# EAGLE schematic mrShark 09 (EAGLE 6.3)

## Sheet 1 of 4
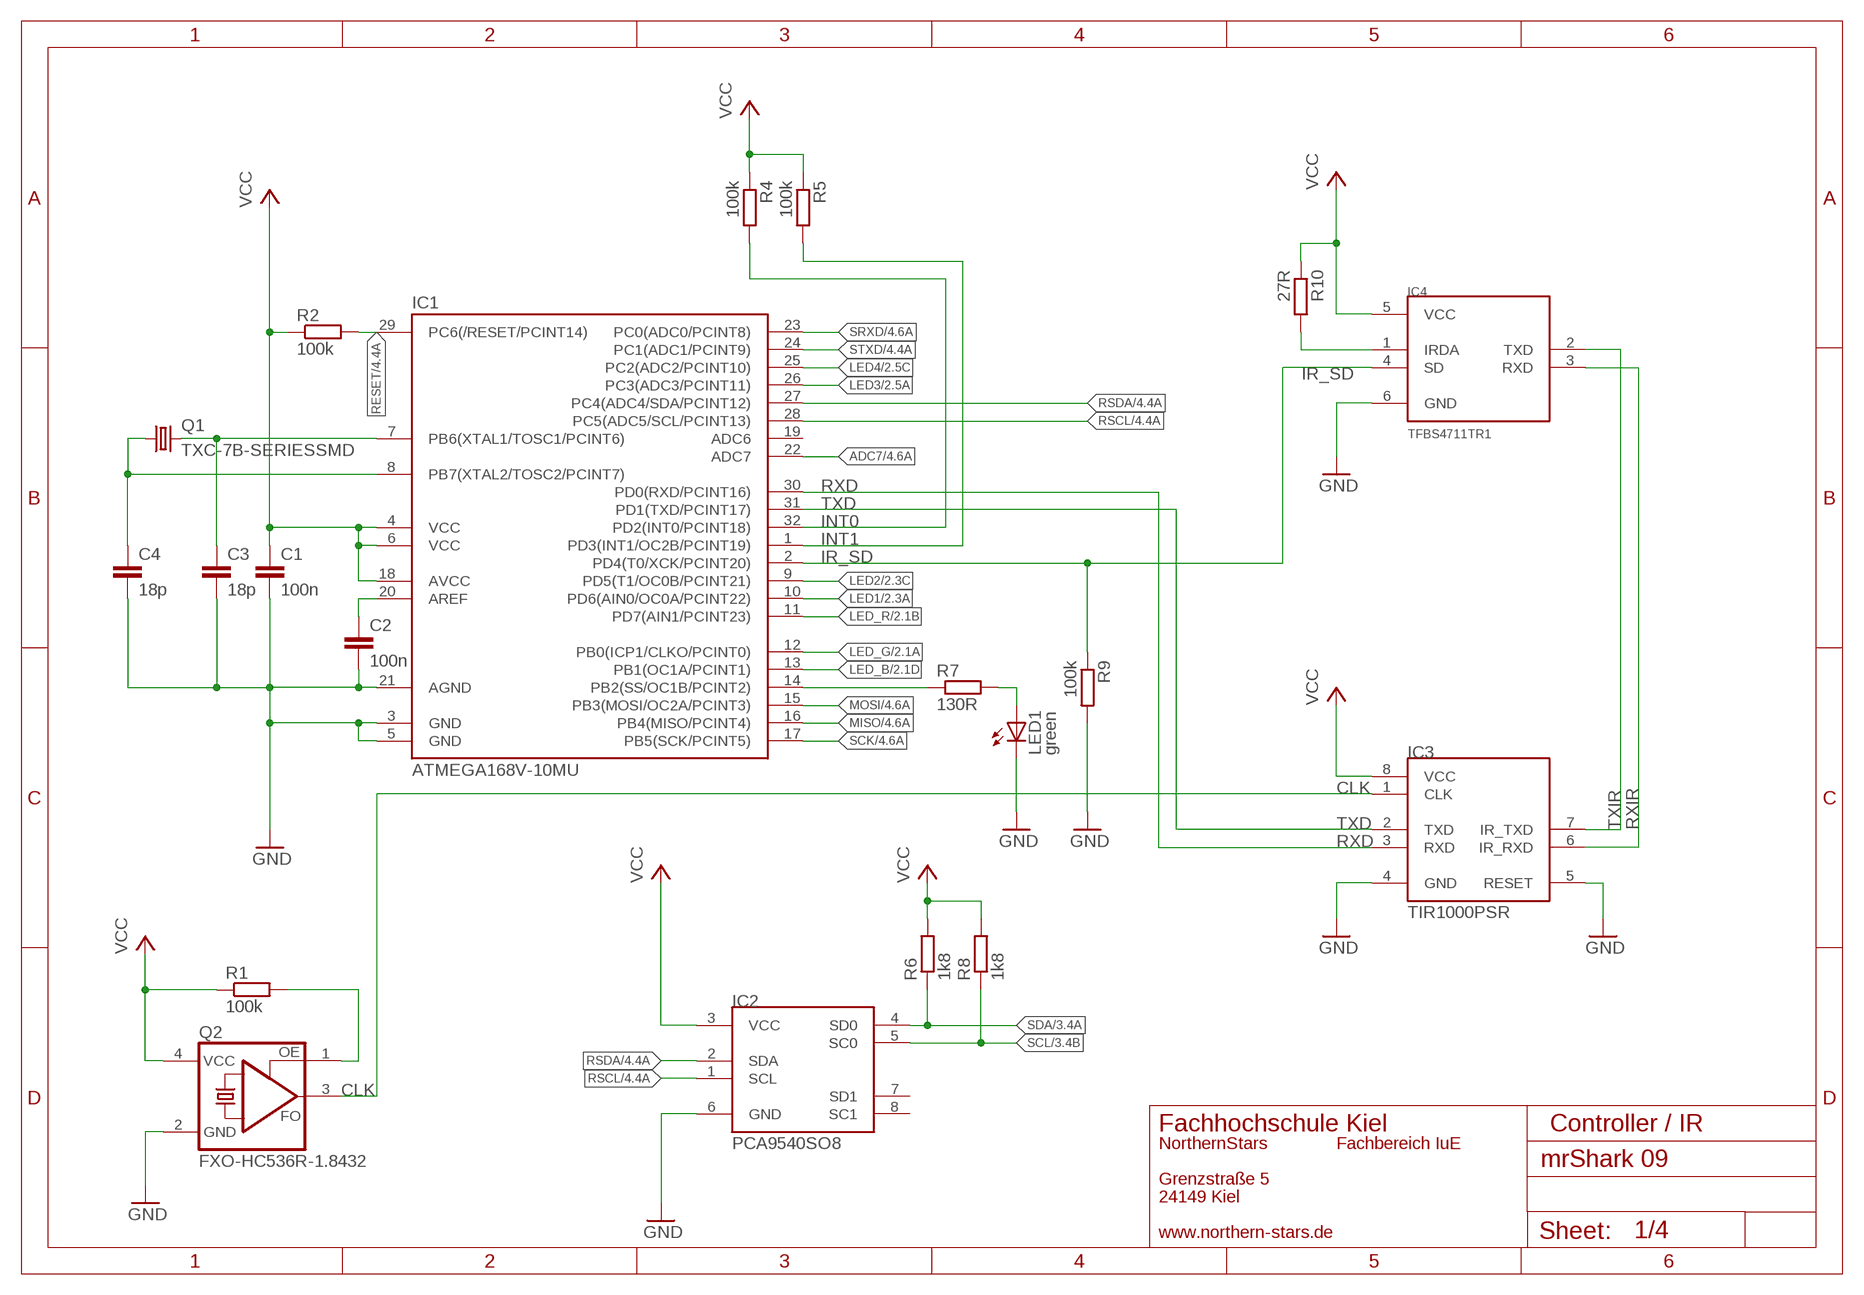
[diagram p0: schematic, sheet 1]

### Parts
C1  100n  C-EUC1206  [C1206]
C2  100n  C-EUC1206  [C1206]
C3  18p  C-EUC0805  [C0805]
C4  18p  C-EUC0805  [C0805]
IC1  ATMEGA168V-10MU  ATMEGA48/88/168-AU  [TQFP32-08]
IC2  PCA9540SO8  [SO8]
IC3  TIR1000PSR  [SO-08]
IC4  TFBS4711TR1  [TFBS4711]
LED1  green  LEDCHIPLED_0603  [CHIPLED_0603]
Q1  TXC-7B-SERIESSMD  [TXC_7B_SERIES]
Q2  FXO-HC536R-1.8432  HC536R  [HC536]
R1  100k  R-EU_R1206  [R1206]
R2  100k  R-EU_R1206  [R1206]
R4  100k  R-EU_R1206  [R1206]
R5  100k  R-EU_R1206  [R1206]
R6  1k8  R-EU_R1206  [R1206]
R7  130R  R-EU_R1206  [R1206]
R8  1k8  R-EU_R1206  [R1206]
R9  100k  R-EU_R1206  [R1206]
R10  27R  R-EU_R1206  [R1206]

### Nets
ADC7: IC1.22(ADC7) ; also sheet 4
CLK: IC3.1(CLK) Q2.3(FO)
GND: C1.2 C2.2 C3.2 C4.2 IC1.3(GND) IC1.5(GND) IC1.21(AGND) IC2.6(GND) IC3.4(GND) IC3.5(RESET) IC4.6(GND) LED1.C Q2.2(GND) R9.2 ; also sheet 2,3,4
INT0: IC1.32(PD2(INT0/PCINT18)) R4.2 ; also sheet 4
INT1: IC1.1(PD3(INT1/OC2B/PCINT19)) R5.2 ; also sheet 4
IR_SD: IC1.2(PD4(T0/XCK/PCINT20)) IC4.4(SD) R9.1
IRDA: IC4.1(IRDA) R10.2
LED1: IC1.10(PD6(AIN0/OC0A/PCINT22)) ; also sheet 2
LED2: IC1.9(PD5(T1/OC0B/PCINT21)) ; also sheet 2
LED3: IC1.26(PC3(ADC3/PCINT11)) ; also sheet 2
LED4: IC1.25(PC2(ADC2/PCINT10)) ; also sheet 2
LED_B: IC1.13(PB1(OC1A/PCINT1)) ; also sheet 2
LED_G: IC1.12(PB0(ICP1/CLKO/PCINT0)) ; also sheet 2
LED_R: IC1.11(PD7(AIN1/PCINT23)) ; also sheet 2
MISO: IC1.16(PB4(MISO/PCINT4)) ; also sheet 4
MOSI: IC1.15(PB3(MOSI/OC2A/PCINT3)) ; also sheet 4
N$3: IC1.14(PB2(SS/OC1B/PCINT2)) R7.1
N$4: Q2.1(OE) R1.2
N$8: LED1.A R7.2
N$13: C3.1 IC1.7(PB6(XTAL1/TOSC1/PCINT6)) Q1.3
N$14: C4.1 IC1.8(PB7(XTAL2/TOSC2/PCINT7)) Q1.1
N$26: C2.1 IC1.20(AREF)
RESET: IC1.29(PC6(/RESET/PCINT14)) R2.2 ; also sheet 4
RSCL: IC1.28(PC5(ADC5/SCL/PCINT13)) IC2.1(SCL) ; also sheet 4
RSDA: IC1.27(PC4(ADC4/SDA/PCINT12)) IC2.2(SDA) ; also sheet 4
RXD: IC1.30(PD0(RXD/PCINT16)) IC3.3(RXD)
RXIR: IC3.6(IR_RXD) IC4.3(RXD)
SCK: IC1.17(PB5(SCK/PCINT5)) ; also sheet 4
SCL: IC2.5(SC0) R8.1 ; also sheet 3,4
SDA: IC2.4(SD0) R6.1 ; also sheet 3,4
SRXD: IC1.23(PC0(ADC0/PCINT8)) ; also sheet 4
STXD: IC1.24(PC1(ADC1/PCINT9)) ; also sheet 4
TXD: IC1.31(PD1(TXD/PCINT17)) IC3.2(TXD)
TXIR: IC3.7(IR_TXD) IC4.2(TXD)
VCC: C1.1 IC1.4(VCC) IC1.6(VCC) IC1.18(AVCC) IC2.3(VCC) IC3.8(VCC) IC4.5(VCC) Q2.4(VCC) R1.1 R2.1 R4.1 R5.1 R6.2 R8.2 R10.1 ; also sheet 2,3,4
Unconnected: IC1.19(ADC6) IC2.7(SD1) IC2.8(SC1)

### Notes on the sheet
- Fachhochschule Kiel | Controller / IR
- NorthernStars | Fachbereich IuE
- Grenzstraße 5
- 24149 Kiel
- www.northern-stars.de

## Sheet 2 of 4
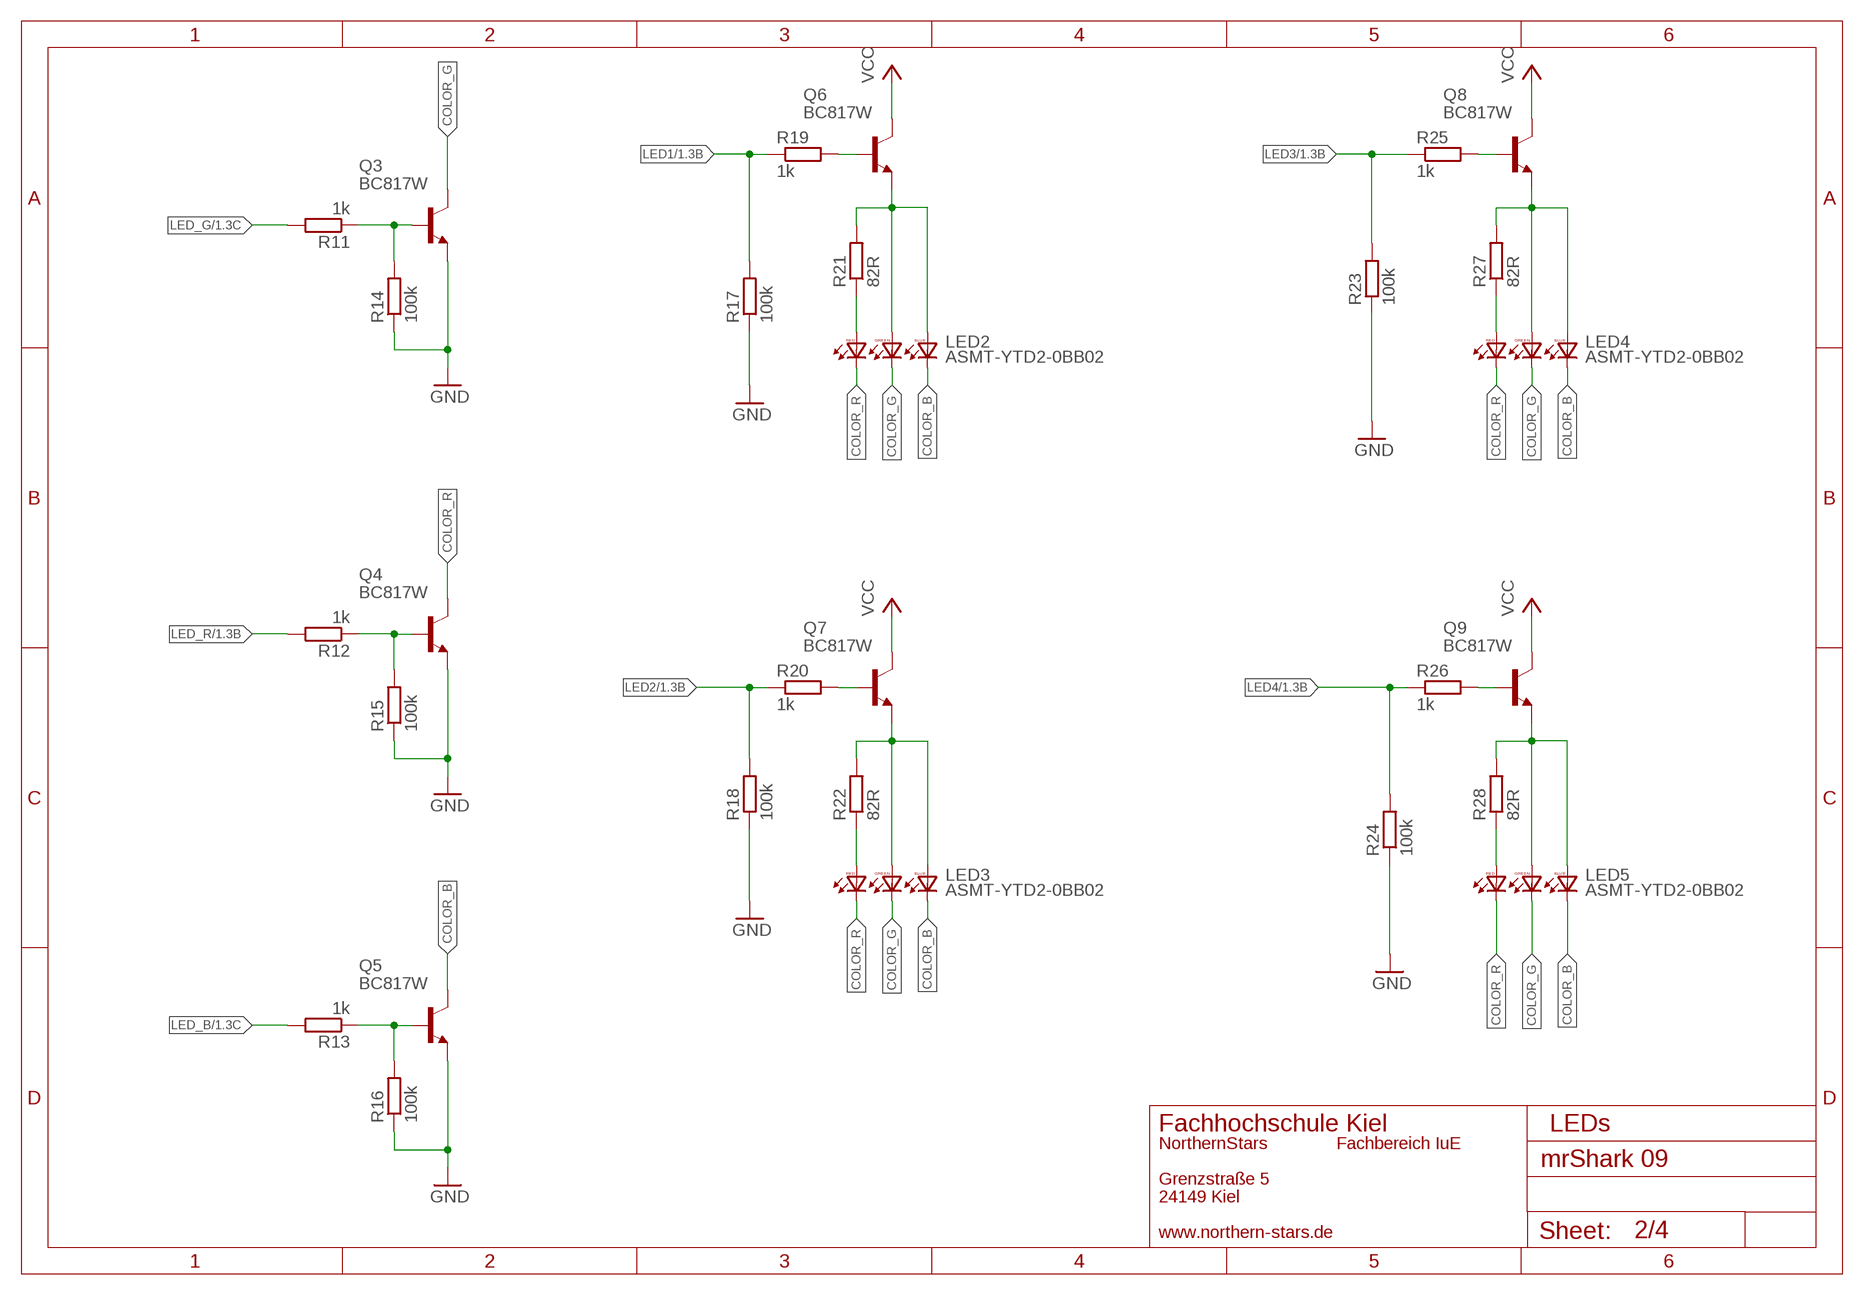
[diagram p1: schematic, sheet 2]

### Parts
LED2  ASMT-YTD2-0BB02  PLCC6K  [PLCC6K]
LED3  ASMT-YTD2-0BB02  PLCC6K  [PLCC6K]
LED4  ASMT-YTD2-0BB02  PLCC6K  [PLCC6K]
LED5  ASMT-YTD2-0BB02  PLCC6K  [PLCC6K]
Q3  BC817W  [SOT323-BEC]
Q4  BC817W  [SOT323-BEC]
Q5  BC817W  [SOT323-BEC]
Q6  BC817W  [SOT323-BEC]
Q7  BC817W  [SOT323-BEC]
Q8  BC817W  [SOT323-BEC]
Q9  BC817W  [SOT323-BEC]
R11  1k  R-EU_R1206  [R1206]
R12  1k  R-EU_R1206  [R1206]
R13  1k  R-EU_R1206  [R1206]
R14  100k  R-EU_R1206  [R1206]
R15  100k  R-EU_R1206  [R1206]
R16  100k  R-EU_R1206  [R1206]
R17  100k  R-EU_R1206  [R1206]
R18  100k  R-EU_R1206  [R1206]
R19  1k  R-EU_R1206  [R1206]
R20  1k  R-EU_R1206  [R1206]
R21  82R  R-EU_R1206  [R1206]
R22  82R  R-EU_R1206  [R1206]
R23  100k  R-EU_R1206  [R1206]
R24  100k  R-EU_R1206  [R1206]
R25  1k  R-EU_R1206  [R1206]
R26  1k  R-EU_R1206  [R1206]
R27  82R  R-EU_R1206  [R1206]
R28  82R  R-EU_R1206  [R1206]

### Nets
COLOR_B: LED2.1(BC) LED3.1(BC) LED4.1(BC) LED5.1(BC) Q5.C
COLOR_G: LED2.2(GC) LED3.2(GC) LED4.2(GC) LED5.2(GC) Q3.C
COLOR_R: LED2.3(RC) LED3.3(RC) LED4.3(RC) LED5.3(RC) Q4.C
GND: Q3.E Q4.E Q5.E R14.1 R15.1 R16.1 R17.1 R18.1 R23.1 R24.1 ; also sheet 1,3,4
LED1: R17.2 R19.1 ; also sheet 1
LED2: R18.2 R20.1 ; also sheet 1
LED3: R23.2 R25.1 ; also sheet 1
LED4: R24.2 R26.1 ; also sheet 1
LED_B: R13.2 ; also sheet 1
LED_G: R11.2 ; also sheet 1
LED_R: R12.2 ; also sheet 1
N$5: LED2.4(RA) R21.1
N$10: LED4.4(RA) R27.1
N$11: LED4.5(GA) LED4.6(BA) Q8.E R27.2
N$15: LED3.4(RA) R22.1
N$16: LED3.5(GA) LED3.6(BA) Q7.E R22.2
N$19: Q7.B R20.2
N$20: LED5.4(RA) R28.1
N$22: LED5.5(GA) LED5.6(BA) Q9.E R28.2
N$23: Q9.B R26.2
N$24: Q8.B R25.2
N$25: Q6.B R19.2
N$27: LED2.5(GA) LED2.6(BA) Q6.E R21.2
VCC: Q6.C Q7.C Q8.C Q9.C ; also sheet 1,3,4
X1: Q5.B R13.1 R16.2
X2: Q4.B R12.1 R15.2
X3: Q3.B R11.1 R14.2

### Notes on the sheet
- Fachhochschule Kiel | LEDs
- NorthernStars | Fachbereich IuE
- Grenzstraße 5
- 24149 Kiel
- www.northern-stars.de

## Sheet 3 of 4
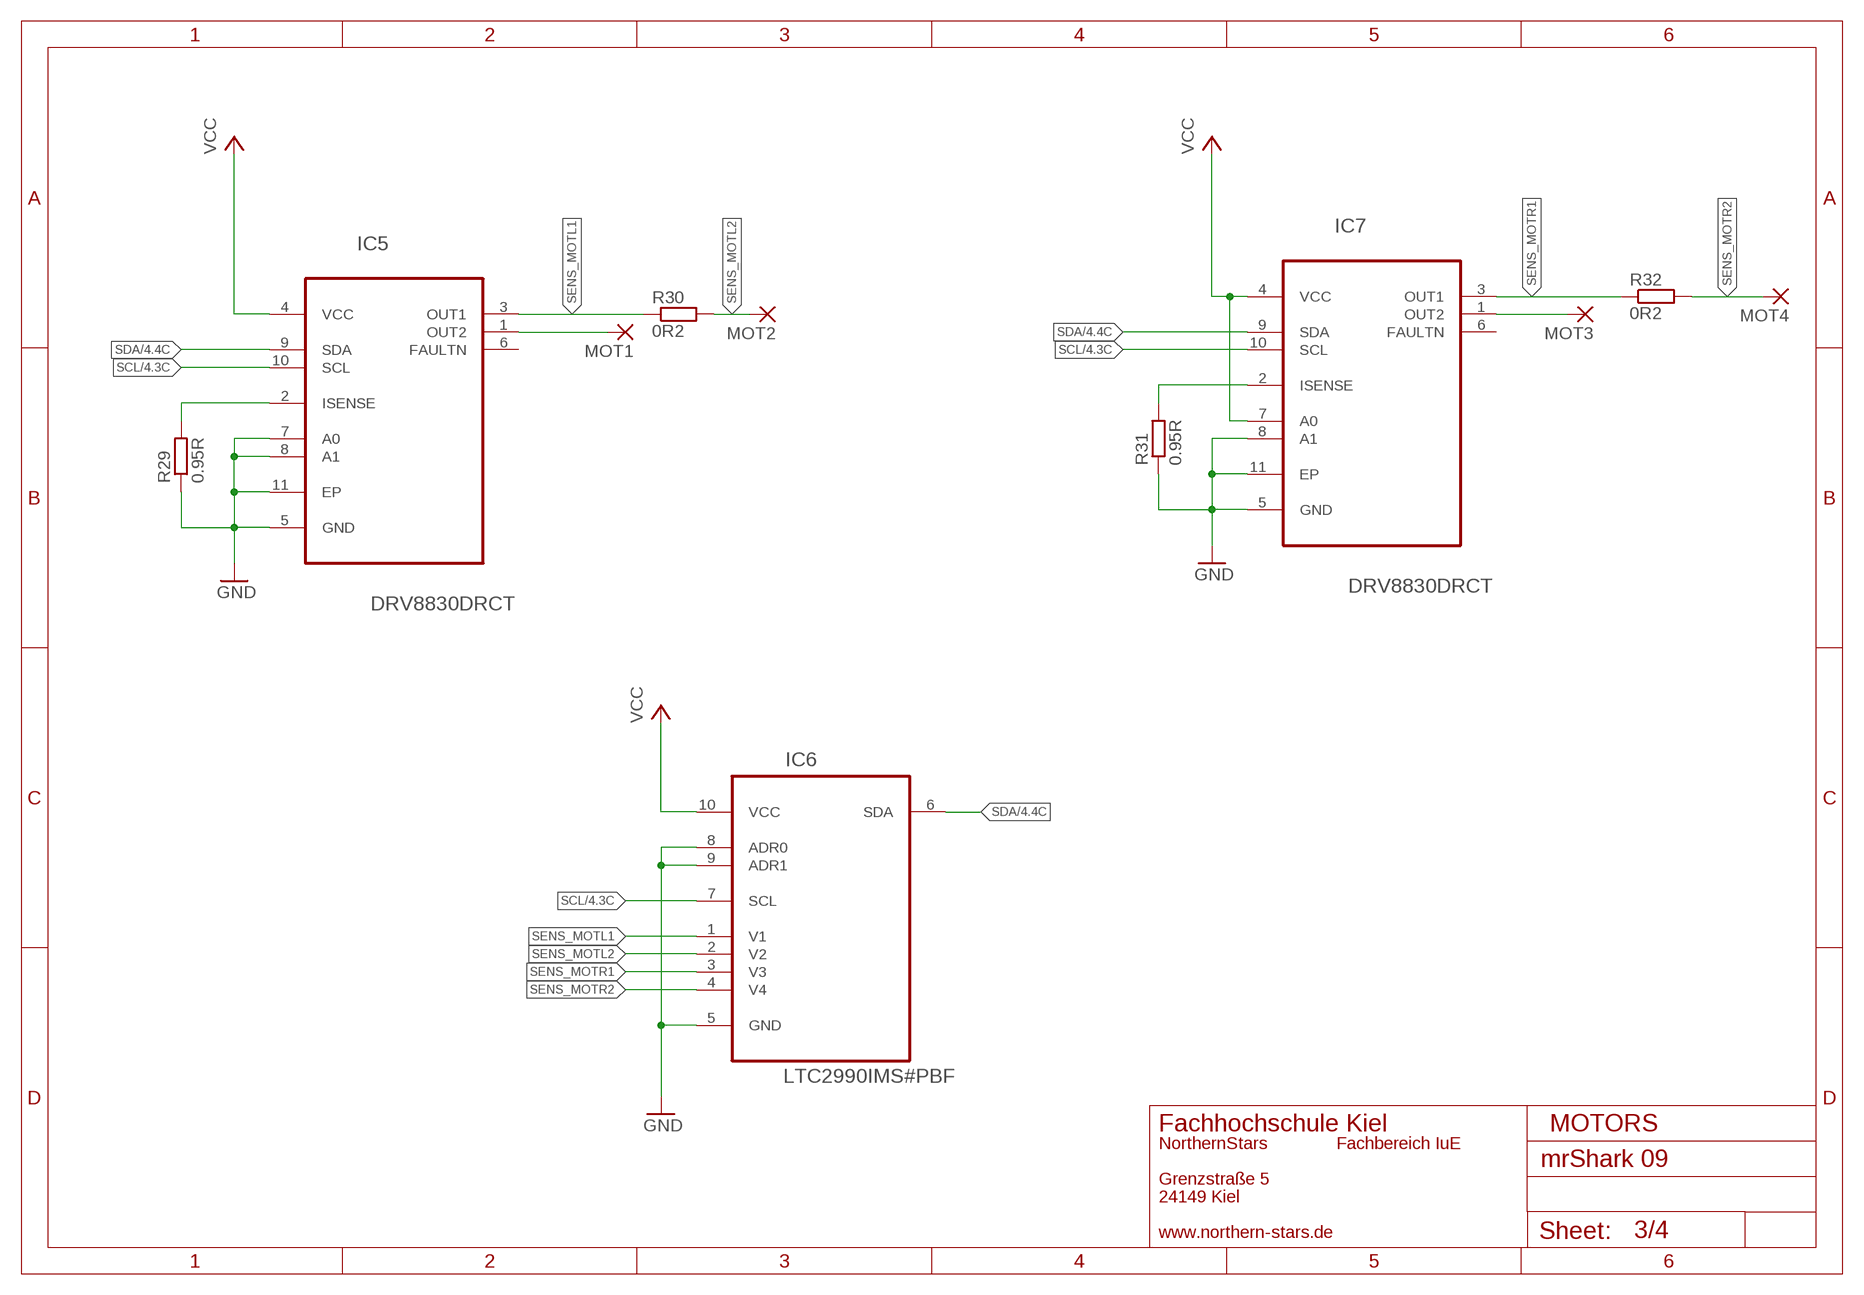
[diagram p2: schematic, sheet 3]

### Parts
IC5  DRV8830DRCT  DRV8830DGQRMSOP  [SOP65P640X110-15N]
IC6  LTC2990IMS#PBF  LTC2990IMSPBF  [SOP50P490X110-10N]
IC7  DRV8830DRCT  DRV8830DGQRMSOP  [SOP65P640X110-15N]
MOT1  SMD5  [SMD2,54-5,08]
MOT2  SMD5  [SMD2,54-5,08]
MOT3  SMD5  [SMD2,54-5,08]
MOT4  SMD5  [SMD2,54-5,08]
R29  0.95R  R-EU_R1206  [R1206]
R30  0R2  R-EU_R1206  [R1206]
R31  0.95R  R-EU_R1206  [R1206]
R32  0R2  R-EU_R1206  [R1206]

### Nets
GND: IC5.5(GND) IC5.7(A0) IC5.8(A1) IC5.11(EP) IC6.5(GND) IC6.8(ADR0) IC6.9(ADR1) IC7.5(GND) IC7.8(A1) IC7.11(EP) R29.1 R31.1 ; also sheet 1,2,4
N$1: IC5.1(OUT2) MOT1.1(P)
N$2: IC5.2(ISENSE) R29.2
N$6: IC7.1(OUT2) MOT3.1(P)
N$7: IC7.2(ISENSE) R31.2
SCL: IC5.10(SCL) IC6.7(SCL) IC7.10(SCL) ; also sheet 1,4
SDA: IC5.9(SDA) IC6.6(SDA) IC7.9(SDA) ; also sheet 1,4
SENS_MOTL1: IC5.3(OUT1) IC6.1(V1) R30.1
SENS_MOTL2: IC6.2(V2) MOT2.1(P) R30.2
SENS_MOTR1: IC6.3(V3) IC7.3(OUT1) R32.1
SENS_MOTR2: IC6.4(V4) MOT4.1(P) R32.2
VCC: IC5.4(VCC) IC6.10(VCC) IC7.4(VCC) IC7.7(A0) ; also sheet 1,2,4
Unconnected: IC5.6(FAULTN) IC7.6(FAULTN)

### Notes on the sheet
- Fachhochschule Kiel | MOTORS
- NorthernStars | Fachbereich IuE
- Grenzstraße 5
- 24149 Kiel
- www.northern-stars.de

## Sheet 4 of 4
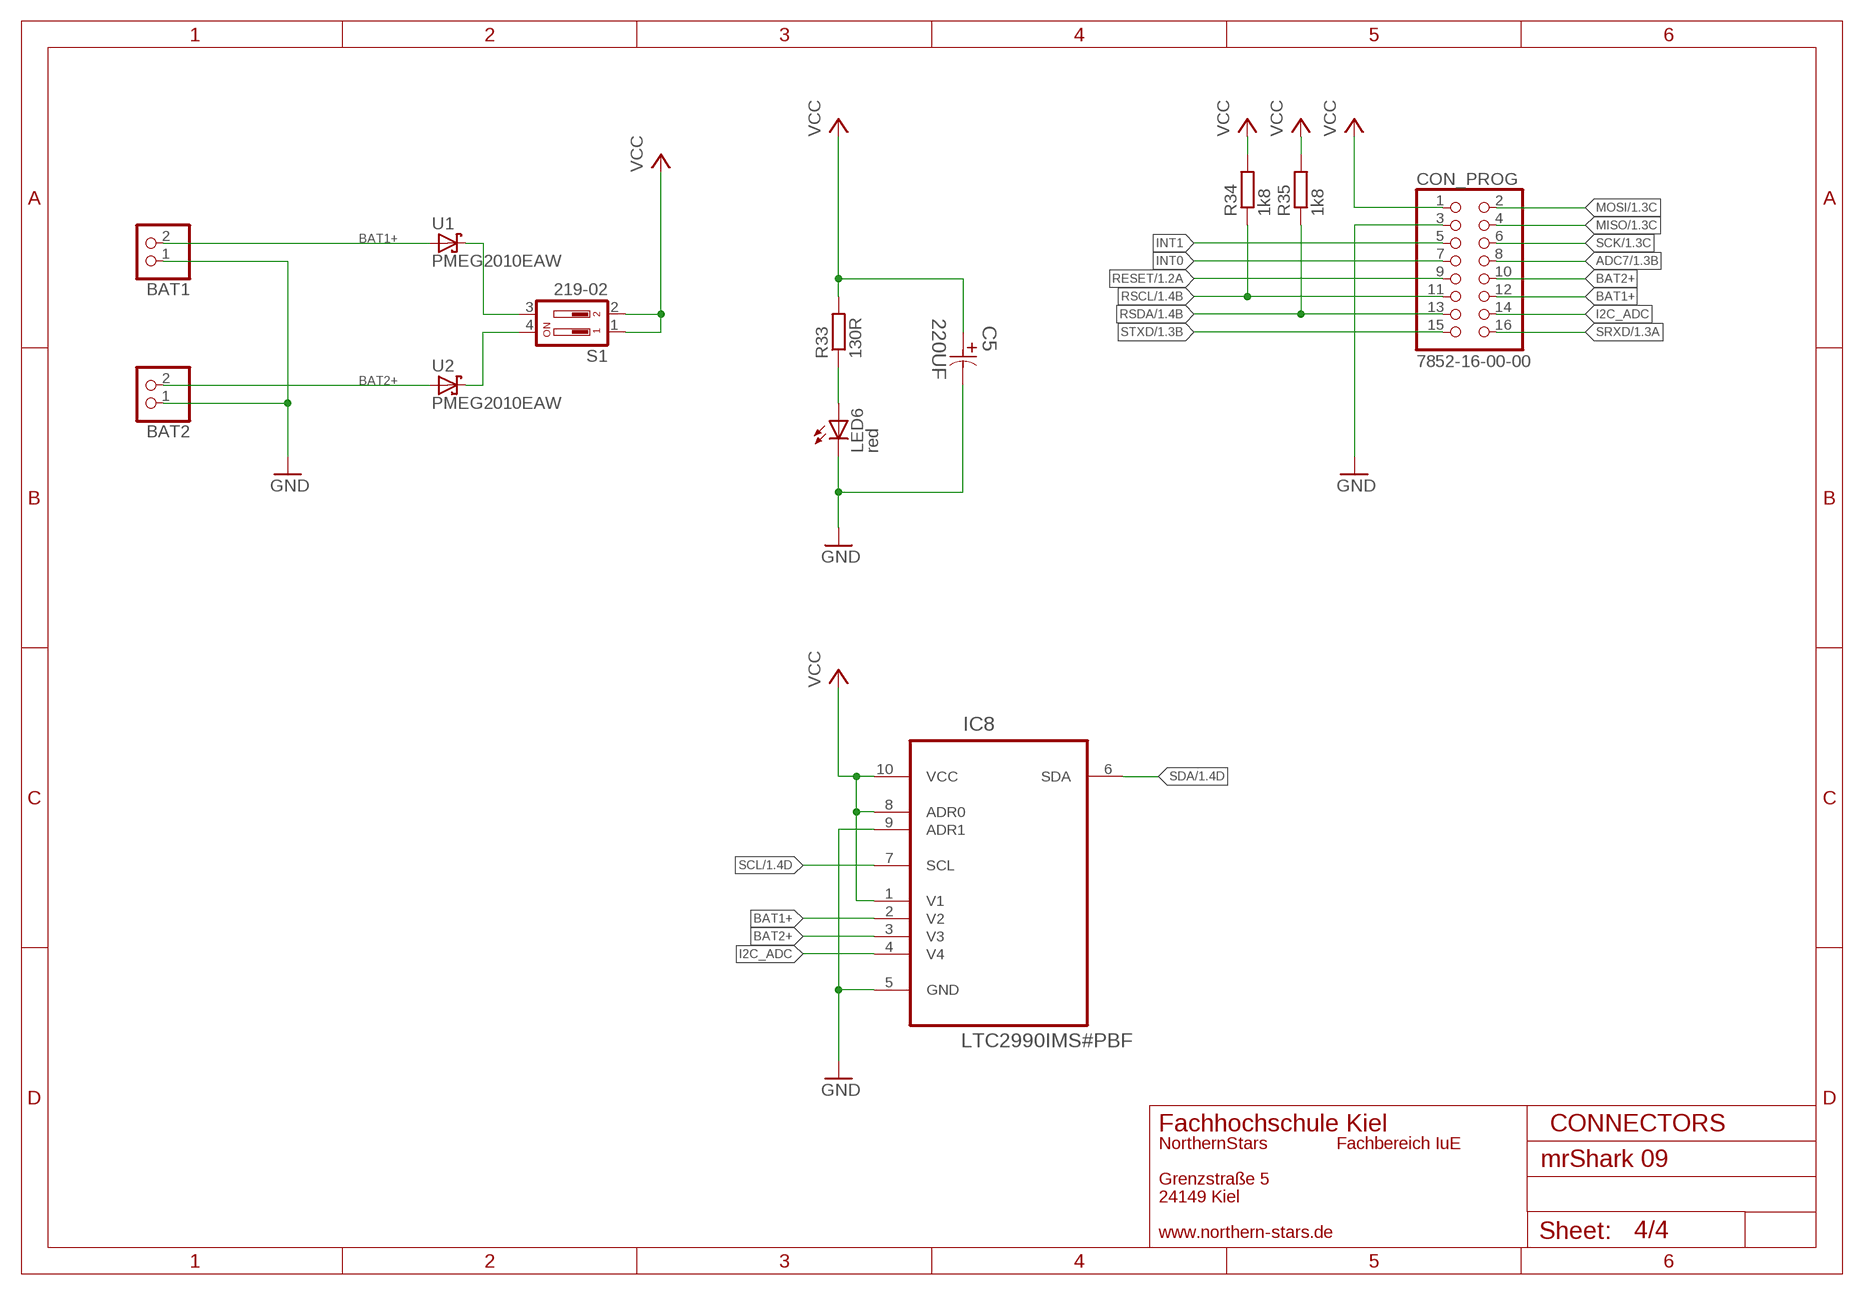
[diagram p3: schematic, sheet 4]

### Parts
BAT1  PINHD-1X02_2.54-SMD  [1X02SMD]
BAT2  PINHD-1X02_2.54-SMD  [1X02SMD]
C5  220UF  EEE-FK1C221XP-CASE-D8  [CAPAE660X800N]
CON_PROG  7852-16-00-00  PINHD-2X08_2.54-SMD  [2X08SMD]
IC8  LTC2990IMS#PBF  LTC2990IMSPBF  [SOP50P490X110-10N]
LED6  red  LEDCHIPLED_0603  [CHIPLED_0603]
R33  130R  R-EU_R1206  [R1206]
R34  1k8  R-EU_R1206  [R1206]
R35  1k8  R-EU_R1206  [R1206]
S1  219-02  [CTS-219-02]
U1  PMEG2010EAW  [SOD323-W]
U2  PMEG2010EAW  [SOD323-W]

### Nets
ADC7: CON_PROG.8 ; also sheet 1
BAT1+: BAT1.2 CON_PROG.12 IC8.2(V2) U1.A
BAT2+: BAT2.2 CON_PROG.10 IC8.3(V3) U2.A
GND: BAT1.1 BAT2.1 C5.2 CON_PROG.3 IC8.5(GND) IC8.9(ADR1) LED6.C ; also sheet 1,2,3
I2C_ADC: CON_PROG.14 IC8.4(V4)
INT0: CON_PROG.7 ; also sheet 1
INT1: CON_PROG.5 ; also sheet 1
MISO: CON_PROG.4 ; also sheet 1
MOSI: CON_PROG.2 ; also sheet 1
N$9: S1.3 U1.C
N$12: S1.4 U2.C
N$28: LED6.A R33.1
RESET: CON_PROG.9 ; also sheet 1
RSCL: CON_PROG.11 R34.1 ; also sheet 1
RSDA: CON_PROG.13 R35.1 ; also sheet 1
SCK: CON_PROG.6 ; also sheet 1
SCL: IC8.7(SCL) ; also sheet 1,3
SDA: IC8.6(SDA) ; also sheet 1,3
SRXD: CON_PROG.16 ; also sheet 1
STXD: CON_PROG.15 ; also sheet 1
VCC: C5.1 CON_PROG.1 IC8.1(V1) IC8.8(ADR0) IC8.10(VCC) R33.2 R34.2 R35.2 S1.1 S1.2 ; also sheet 1,2,3

### Notes on the sheet
- Fachhochschule Kiel | CONNECTORS
- NorthernStars | Fachbereich IuE
- Grenzstraße 5
- 24149 Kiel
- www.northern-stars.de

## Library data of the parts
BAT1 BAT2 = pinhead-2:PINHD-1X02: PIN HEADER
C1-C4 = rcl:C-EU: CAPACITOR, European symbol
C5 = Panasonic-EEEFK_EEEFP:EEE-: Aluminum Electrolytic Capacitors,Surface Mount Type; MPN: EEE-FK1C221XP; OC_FARNELL: 1850103; OC_NEWARK: 23T0845; PACKAGE: CASE-D8; SUPPLIER: PANASONIC; TOLERANCE: ±20 %; VOLTAGERATING: 16V
CON_PROG = pinhead-2:PINHD-2X08: PIN HEADER
IC1 = atmega8:ATMEGA48/88/168
IC2 = nxp:PCA9540: PCA9540 2-channel I2C-bus multiplexer
IC3 = texas:TIR1000: Texas Instruments TIR1000 STANDALONE IrDATM ENCODER AND DECODER
IC4 = vishay:TFBS4711: TRANSCEIVER IRDA Vishay TFBS4711-TR1 Infrared Transciever 900nm, 600µA, 1m range
IC5 IC7 = texas:DRV8830DGQR: LOW-VOLTAGE MOTOR DRIVER WITH SERIAL INTERFACE; MPN: DRV8830DGQR; OC_FARNELL: 1863106; OC_NEWARK: 58T1482; PACKAGE: MSOP-10; SUPPLIER: TEXAS INSTRUMENTS
IC6 IC8 = linear-technology:LTC2990IMSPBF: Quad I2C Voltage, Current and Temperature Monitor Measures Voltage, Current and Temperature Measures Two Remote Diode Temperatures; DESCRIPTION: I2C Temperature, Voltage and Current Monitor; MPN: LTC2990IMS#PBF; OC_FARNELL: 1898629; OC_NEWARK: 13T3889; PACKAGE: MSOP-10; SUPPLIER: Linear Technology
LED1 LED6 = led:LED: LED OSRAM: - CHIPLED LG R971, LG N971, LY N971, LG Q971, LY Q971, LO R971, LY R971 LH N974, LH R974 LS Q976, LO Q976, LY Q976 LO Q996 - Hyper CHIPLED LW Q18S LB Q993, LB Q99A, LB R99A - SideLED LS A670, LO A670, LY A670, LG A670, LP A670 LB A673, LV A673, LT A673, LW A673 LH A674 LY A675 LS A676, LA A676, LO A676, LY A676, LW A676 LS A679, LY A679, LG A679 - Hyper Micro SIDELED® LS Y876, LA Y876, LO Y876, LY Y876 LT Y87S - SmartLED LW L88C, LW L88S LB L89C, LB L89S, LG L890 LS L89K, LO L89K, LY L89K LS L896, LA L896, LO L896, LY L896 - TOPLED LS T670, LO T670, LY T670, LG T670, LP T670 LSG T670, LSP T670, LSY T670, LOP T670, LYG T670 LG T671, LOG T671, LSG T671 LB T673, LV T673, LT T673, LW T673 LH T674 LS T676, LA T676, LO T676, LY T676, LB T676, LH T676, LSB T676, LW T676 LB T67C, LV T67C, LT T67C, LS T67K, LO T67K, LY T67K, LW E67C LS E67B, LA E67B, LO E67B, LY E67B, LB E67C, LV E67C, LT E67C LW T67C LS T679, LY T679, LG T679 LS T770, LO T770, LY T770, LG T770, LP T770 LB T773, LV T773, LT T773, LW T773 LH T774 LS E675, LA E675, LY E675, LS T675 LS T776, LA T776, LO T776, LY T776, LB T776 LHGB T686 LT T68C, LB T68C - Hyper Mini TOPLED® LB M676 - Mini TOPLED Santana® LG M470 LS M47K, LO M47K, LY M47K Source: http://www.osram.convergy.de LUXEON: - LUMILED® LXK2-PW12-R00, LXK2-PW12-S00, LXK2-PW14-U00, LXK2-PW14-V00 LXK2-PM12-R00, LXK2-PM12-S00, LXK2-PM14-U00 LXK2-PE12-Q00, LXK2-PE12-R00, LXK2-PE12-S00, LXK2-PE14-T00, LXK2-PE14-U00 LXK2-PB12-K00, LXK2-PB12-L00, LXK2-PB12-M00, LXK2-PB14-N00, LXK2-PB14-P00, LXK2-PB14-Q00 LXK2-PR12-L00, LXK2-PR12-M00, LXK2-PR14-Q00, LXK2-PR14-R00 LXK2-PD12-Q00, LXK2-PD12-R00, LXK2-PD12-S00 LXK2-PH12-R00, LXK2-PH12-S00 LXK2-PL12-P00, LXK2-PL12-Q00, LXK2-PL12-R00 Source: www.luxeon.com KINGBRIGHT: KA-3528ASYC Source: www.kingbright.com
LED2-LED5 = led:PLCC6: Standart PLCC6 Package RGB LED
MOT1-MOT4 = wirepad:SMD5: SMD PAD
Q1 = crystal:TXC-7B-SERIES: TXC 7B SERIES Ultra small SMD type cristial 8-100Mhz
Q2 = crystal:HC536: Crystal HC536R For example: Fox Electronics FOX-HC536R
Q3-Q9 = transistor-npn:BC817*: NPN Transistor
R1 R2 R4-R35 = rcl:R-EU_: RESISTOR, European symbol
S1 = switch-dil:219-02*: Surface Mount DIP Switch Series 219 SMT CTS Electronic Components Sourc: www.ctscorp.com
U1 U2 = diode:PMEG2010EA: NXP - Low V F (MEGA) Schottky barrier diode If = 1A, Vr = 20V http://www.farnell.com/datasheets/687996.pdf